# Altium schematic sheet Power.SchDoc
size A3; SheetNumber: 3; SheetTotal: 6
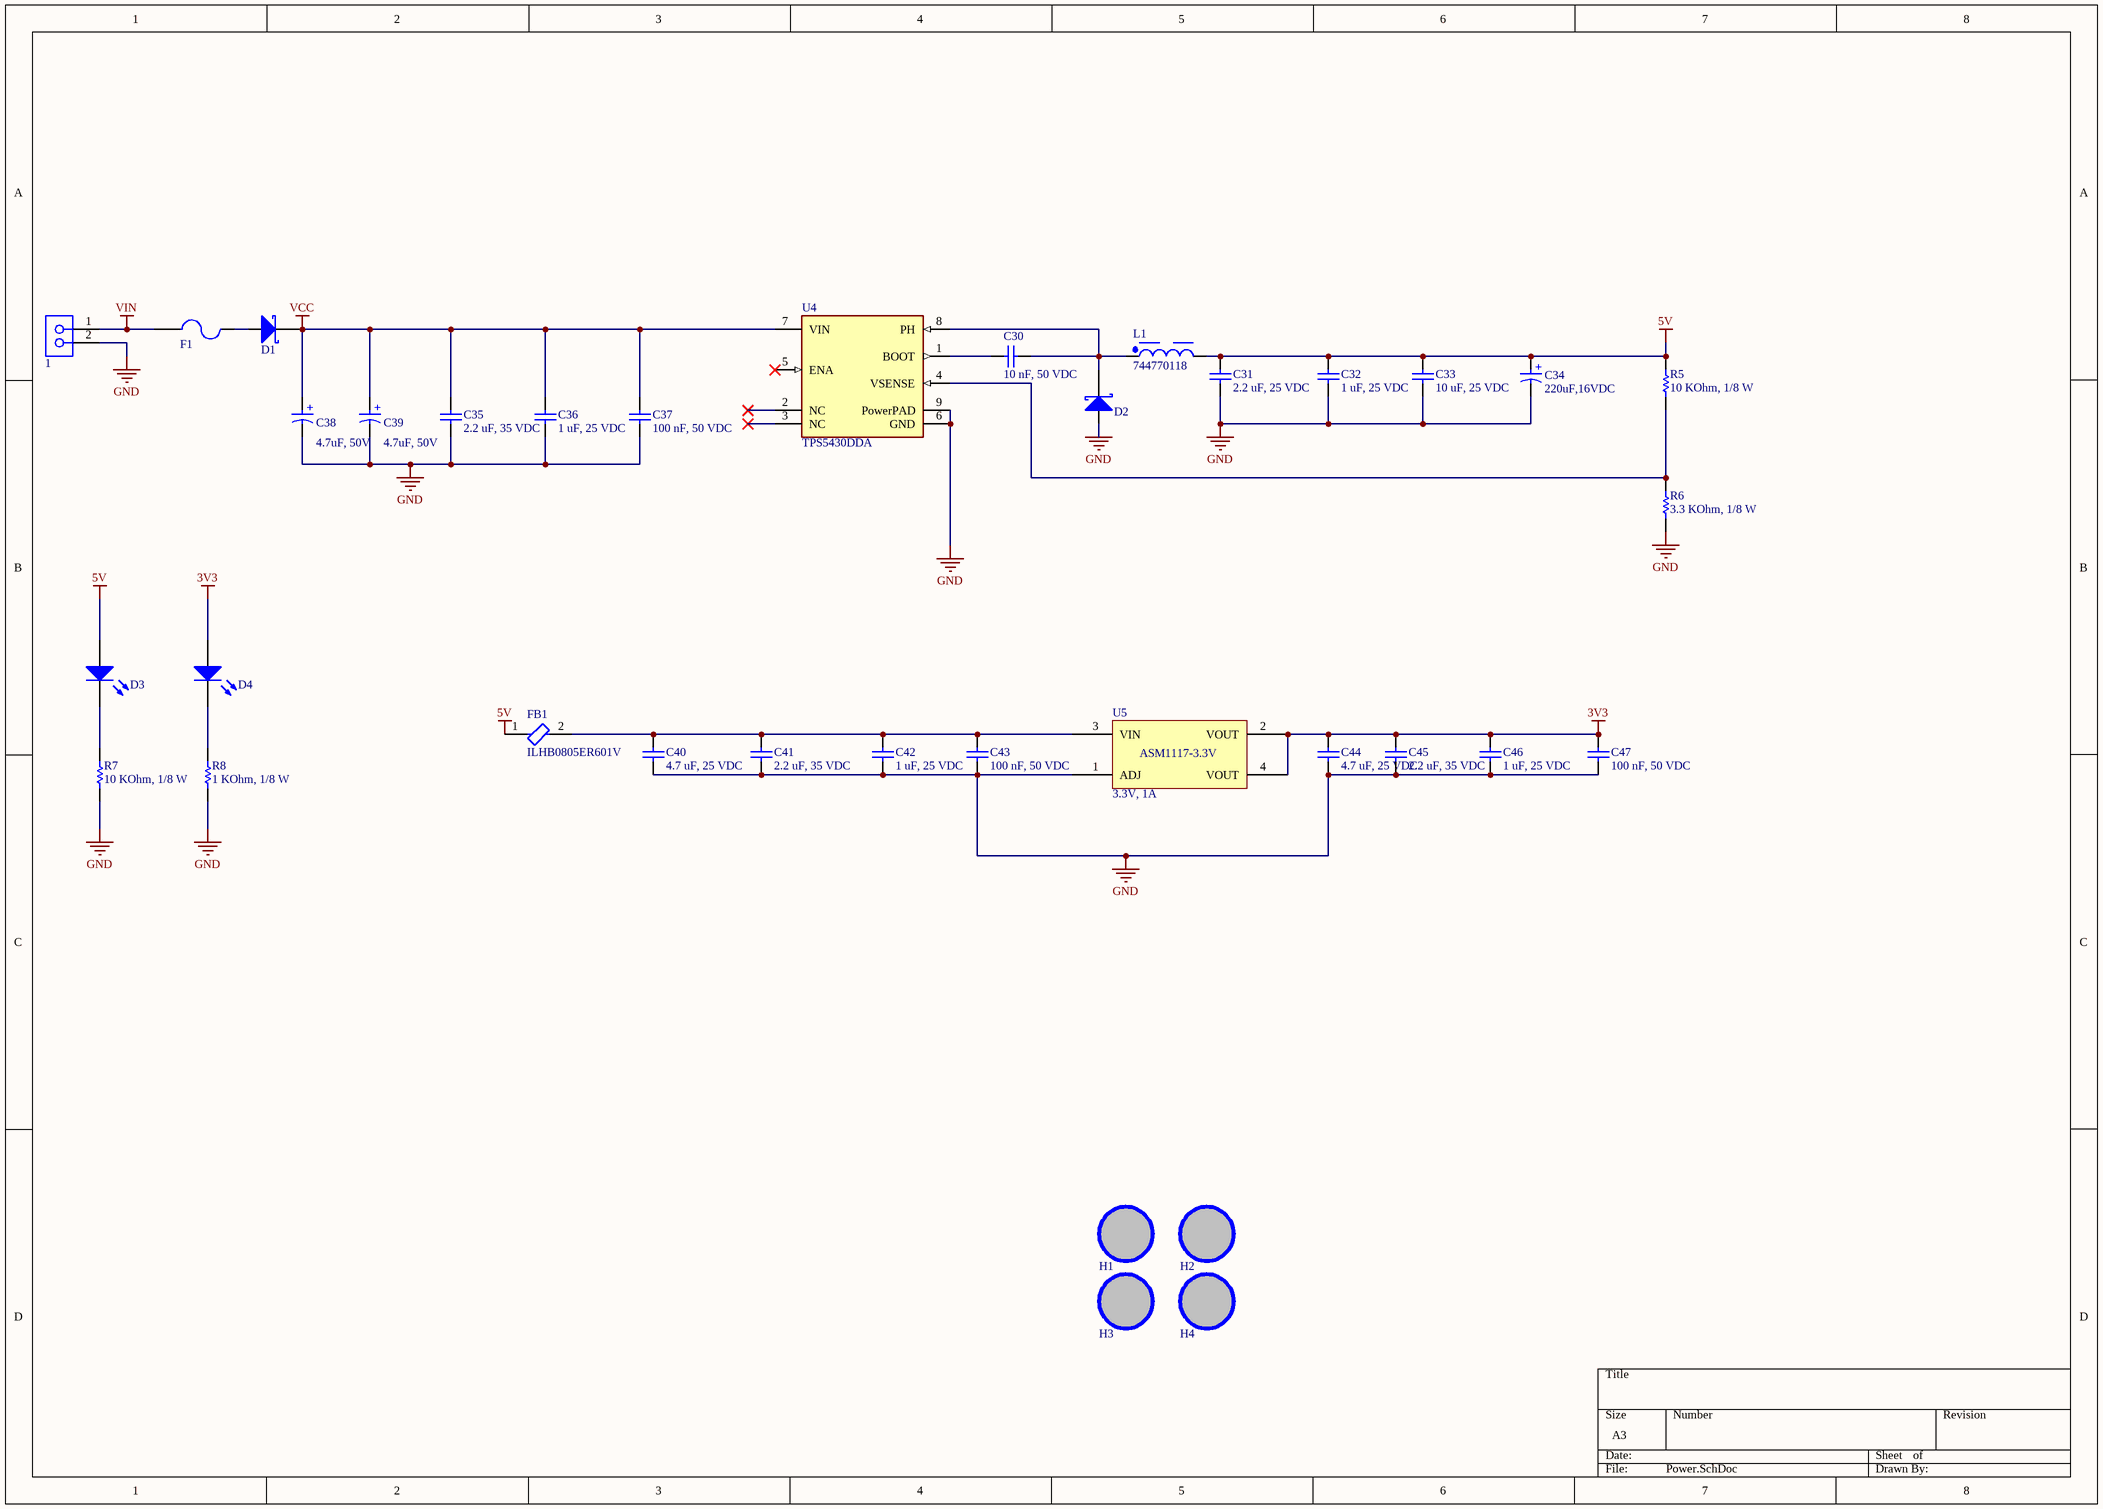
[diagram p0: Power.SchDoc]

## Parts
1  4A, 300V  [691418420002]  (value not drawn)
C30  10 nF, 50 VDC  [CAP_0805]
C31  2.2 uF, 25 VDC  [CAP_0805]
C32  1 uF, 25 VDC  [CAP_0805]
C33  10 uF, 25 VDC  [CAP_0805]
C34  220uF,16VDC  [WCAP-ASLI_D6.3H7.7]
C35  2.2 uF, 35 VDC  [CAP_0805]
C36  1 uF, 25 VDC  [CAP_0805]
C37  100 nF, 50 VDC  [CAP_0805]
C38  4.7uF, 50V  [WCAP-ASLI_D4H5.5]
C39  4.7uF, 50V  [WCAP-ASLI_D4H5.5]
C40  4.7 uF, 25 VDC  [CAP_0805]
C41  2.2 uF, 35 VDC  [CAP_0805]
C42  1 uF, 25 VDC  [CAP_0805]
C43  100 nF, 50 VDC  [CAP_0805]
C44  4.7 uF, 25 VDC  [CAP_0805]
C45  2.2 uF, 35 VDC  [CAP_0805]
C46  1 uF, 25 VDC  [CAP_0805]
C47  100 nF, 50 VDC  [CAP_0805]
D1  D Schottky  [SS34]  (value not drawn)
D2  D Schottky  [SS34]  (value not drawn)
D3  LED SMD  [LED_0805_Blue]  (value not drawn)
D4  LED SMD  [LED_0805_Blue]  (value not drawn)
F1  Fuse  [FUSE SMD]  (value not drawn)
FB1  ILHB0805ER601V  [FP-ILHB-0805-IPC_C]
H1  Hole  [LO KHOAN 3MM]  (value not drawn)
H2  Hole  [LO KHOAN 3MM]  (value not drawn)
H3  Hole  [LO KHOAN 3MM]  (value not drawn)
H4  Hole  [LO KHOAN 3MM]  (value not drawn)
L1  744770118  [WE-PD_1280]
R5  10 KOhm, 1/8 W  [RESISTOR_0805]
R6  3.3 KOhm, 1/8 W  [RESISTOR_0805]
R7  10 KOhm, 1/8 W  [RESISTOR_0805]
R8  1 KOhm, 1/8 W  [RESISTOR_0805]
U4  TPS5430DDA  [FP-DDA0008J-MFG]
U5  3.3V, 1A  [AMS1117-3.3V SOT223]

## Nets
3V3: C44.2 C45.2 C46.2 C47.2 D4.1(A) U5.2(VOUT) U5.4(VOUT)
5V: C31.2 C32.2 C33.2 C34.1(P) D3.1(A) FB1.1 L1.2 R5.2
GND: 1.2 C31.1 C32.1 C33.1 C34.2(N) C35.1 C36.1 C37.1 C38.2(N) C39.2(N) C40.1 C41.1 C42.1 C43.1 C44.1 C45.1 C46.1 C47.1 D2.1(A) R6.1 R7.1 R8.1 U4.6(GND) U4.9(PowerPAD) U5.1(ADJ)
VCC: C35.2 C36.2 C37.2 C38.1(P) C39.1(P) D1.2(K) U4.7(VIN)
VIN: 1.1 F1.1
NetC30_1: C30.1 D2.2(K) L1.1 U4.8(PH)
NetC30_2: C30.2 U4.1(BOOT)
NetC40_2: C40.2 C41.2 C42.2 C43.2 FB1.2 U5.3(VIN)
NetD1_1: D1.1(A) F1.2
NetD3_2: D3.2(K) R7.2
NetD4_2: D4.2(K) R8.2
NetR5_1: R5.1 R6.2 U4.4(VSENSE)

Not connected (* = marked no-connect by the designer): H1 1; H2 1; H3 1; H4 1; U4 2(NC)* 3(NC)* 5(ENA)*

## Notes on the sheet
- (in symbol 865080345012) +
- (in symbol 865080640004) +
- (in symbol AMS1117-3.3V) ASM1117-3.3V

## Library data of the parts
1 = 691418420002: WR-TBL Series 4184 45° Entry, THT, pitch 7.62mm, 2p; Manufacturer: Wurth Elektronik; Modularity: No; ComponentLink1Description: Datasheet Link; ComponentLink1URL: https://www.we-online.com/redexpert/spec/691418420002?ad; ComponentLink2Description: Supplier 1 URL; ComponentLink2URL: N/A; Manufacturer Part Number: 691418420002; Category: Terminal Blocks; Match Code: WR-TBL; Mount: Through Hole; Operating Temperature Max: 120°C; Operating Temperature Min: -30°C; Packaging: Box; Application: Screwless; Number of Pins: 2; Number of Rows: 1; Orientation: 45°; Pitch: 7.62mm; Rated Current: 4A; Working Voltage: 300V; ComponentLink3Description: Supplier 2 URL; ComponentLink3URL: N/A; ComponentLink4Description: Supplier 3 URL; ComponentLink4URL: https://www.thegioiic.com/hb762-2-terminal-khoi-han-pcb-2-cuc-24a-450v-7-62mm; Supplier 1 Name: Mouser; Supplier 1 SN: N/A; Supplier 1 URL: N/A; Supplier 2 Name: Digi-Key; Supplier 2 SN: N/A; Supplier 2 URL: N/A; Supplier 3 Name: thegioiic; Supplier 3 SN: N/A; Supplier 3 URL: https://www.thegioiic.com/hb762-2-terminal-khoi-han-pcb-2-cuc-24a-450v-7-62mm; Value: 4A, 300V
C30 = 0108051031050: CAP, size 0805, 10 nF, 50 VDC; Manufacture Name: TDK; Manufacture SN: CGA4C2C0G1H103J060AA; Capacitance: 10 nF; Tolerance: +/-5%; Voltage Rating DC: 50 VDC; ComponentLink2Description: Datasheet; ComponentLink2URL: https://product.tdk.com/system/files/dam/doc/product/capacitor/ceramic/mlcc/catalog/mlcc_automotive_general_en.pdf?ref_disty=mouser; Operating Temperature: -55 to +125degC; Packaging: Tape and Reel; Mounting Technology: SMT; Size: 0805; Supplier 1 Name: Mouser; Supplier 1 SN: 810-CGA4C2C0G1H103J; Supplier 1 URL: https://www.mouser.vn/ProductDetail/TDK/CGA4C2C0G1H103J060AA?qs=FxQuwy19cyC9M6v0nMqjhA%3D%3D&utm_source=mouser-refine-download&utm_medium=file&utm_campaign=CGA4C2C0G1H103J060AA&utm_content=TDK; Supplier 2 Name: Digi-Key; Supplier 2 SN: 445-6947-2-ND; Supplier 2 URL: https://www.digikey.com/en/products/detail/tdk-corporation/cga4c2c0g1h103j060aa/2672840; Supplier 3 Name: thegioiic; Supplier 3 SN: OEM; Supplier 3 URL: N/A; Value: 10 nF, 50 VDC
C31 = 0108052251025: CAP, size 0805, 2.2 uF, 25 VDC; Manufacture Name: TDK; Manufacture SN: CGA4J3X7R1E225K125AD; Capacitance: 2.2 uF; Tolerance: +/-10%; Voltage Rating DC: 25 VDC; ComponentLink2Description: Datasheet; ComponentLink2URL: https://product.tdk.com/system/files/dam/doc/product/capacitor/ceramic/mlcc/catalog/mlcc_automotive_epoxy_en.pdf?ref_disty=mouser; Operating Temperature: -55 to +125degC; Packaging: Tape and Reel; Mounting Technology: SMT; Size: 0805; Supplier 1 Name: Mouser; Supplier 1 SN: 810-CGA4J3X7R1E225KD; Supplier 1 URL: https://www.mouser.vn/ProductDetail/TDK/CGA4J3X7R1E225K125AD?qs=xLDY6iXSiQZ6drRfaPQTzQ%3D%3D&utm_source=mouser-refine-download&utm_medium=file&utm_campaign=CGA4J3X7R1E225K125AD&utm_content=TDK; Supplier 2 Name: Digi-Key; Supplier 2 SN: 445-9923-2-ND; Supplier 2 URL: https://www.digikey.com/en/products/detail/tdk-corporation/cga4j3x7r1e225k125ad/3933656; Supplier 3 Name: thegioiic; Supplier 3 SN: OEM; Supplier 3 URL: N/A; Value: 2.2 uF, 25 VDC
C32 C36 C42 C46 = 0108051051025: CAP, size 0805, 1 uF, 25 VDC; Manufacture Name: TDK; Manufacture SN: CGA4J1X8R1E105K125AE; Capacitance: 1 uF; Tolerance: +/-10%; Voltage Rating DC: 25 VDC; ComponentLink2Description: Datasheet; ComponentLink2URL: https://product.tdk.com/system/files/dam/doc/product/capacitor/ceramic/mlcc/catalog/mlcc_automotive_soft_en.pdf?ref_disty=mouser; Operating Temperature: -55 to +125degC; Packaging: Tape and Reel; Mounting Technology: SMT; Size: 0805; Supplier 1 Name: Mouser; Supplier 1 SN: 810-A4J1X815K125AE; Supplier 1 URL: https://www.mouser.vn/ProductDetail/TDK/CGA4J1X8R1E105K125AE?qs=Ii670aiJhr6VRhkBsruYJg%3D%3D&utm_source=mouser-refine-download&utm_medium=file&utm_campaign=CGA4J1X8R1E105K125AE&utm_content=TDK; Supplier 2 Name: Digi-Key; Supplier 2 SN: 445-174807-2-ND; Supplier 2 URL: https://www.digikey.com/en/products/detail/tdk-corporation/cga4j1x8r1e105k125ae/6556490; Supplier 3 Name: thegioiic; Supplier 3 SN: OEM; Supplier 3 URL: N/A; Value: 1 uF, 25 VDC
C33 = 0108051061025: CAP, size 0805, 10 uF, 25 VDC; Manufacture Name: TDK; Manufacture SN: CGA4J1X7S1E106K125AE; Capacitance: 10 uF; Tolerance: +/-10%; Voltage Rating DC: 25 VDC; ComponentLink2Description: Datasheet; ComponentLink2URL: https://product.tdk.com/system/files/dam/doc/product/capacitor/ceramic/mlcc/catalog/mlcc_automotive_soft_en.pdf?ref_disty=mouser; Operating Temperature: -55 to +125degC; Packaging: Tape and Reel; Mounting Technology: SMT; Size: 0805; Supplier 1 Name: Mouser; Supplier 1 SN: 810-CGA4J1X7S1E106K2; Supplier 1 URL: https://www.mouser.vn/ProductDetail/TDK/CGA4J1X7S1E106K125AE?qs=PqoDHHvF64%252BJvhmUzM2odA%3D%3D&utm_source=mouser-refine-download&utm_medium=file&utm_campaign=CGA4J1X7S1E106K125AE&utm_content=TDK; Supplier 2 Name: Digi-Key; Supplier 2 SN: 445-181411-2-ND; Supplier 2 URL: https://www.digikey.com/en/products/detail/tdk-corporation/cga4j1x7s1e106k125ae/9744777; Supplier 3 Name: thegioiic; Supplier 3 SN: OEM; Supplier 3 URL: N/A; Value: 10 uF, 25 VDC
C34 = 865080345012: V-Chip, D6.3 x H7.7mm, 220uF, 16V; Manufacturer: Wurth Elektronik; Capacitance Tolerance: +/-20%; Dissipation Factor: 16%; Endurance: 2000h; Leakage Current: 35.2uA; Ripple Current: 275mA; Category: Aluminum Electrolytic Capacitors; ComponentLink2Description: Datasheet Link; ComponentLink2URL: https://www.we-online.com/redexpert/spec/865080345012?ad; Mount: Surface Mount; Operating Temperature Max: 105°C; Operating Temperature Min: -55°C; Packaging: Tape and Reel; Height: 7.7mm; Diameter: 6.3mm; Capacitance: 220uF; Rated Voltage (DC): 16V; Supplier 1 Name: Mouser; Supplier 1 SN: 710-865080345012; Supplier 1 URL: https://www.mouser.com/ProductDetail/Wurth-Elektronik/865080345012?qs=0KOYDY2FL28fdpLe2qFZOQ%3D%3D; Supplier 3 Name: thegioiic; Supplier 3 URL: https://www.thegioiic.com/tu-nhom-smd-220uf-16v-6-3x7-7mm; Manufacturer Part Number: N/A; Supplier 2 Name: Digi-Key; Supplier 2 SN: N/A; Supplier 2 URL: N/A; Supplier 3 SN: N/A; Value: 220uF, 16V
C35 C41 C45 = 0108052251035: CAP, size 0805, 2.2 uF, 35 VDC; Manufacture Name: TDK; Manufacture SN: CGA4J1X7R1V225K125AC; Capacitance: 2.2 uF; Tolerance: +/-10%; Voltage Rating DC: 35 VDC; ComponentLink2Description: Datasheet; ComponentLink2URL: https://product.tdk.com/system/files/dam/doc/product/capacitor/ceramic/mlcc/catalog/mlcc_automotive_general_en.pdf?ref_disty=mouser; Operating Temperature: -55 to +125degC; Packaging: Tape and Reel; Mounting Technology: SMT; Size: 0805; Supplier 1 Name: Mouser; Supplier 1 SN: 810-CGA4J1X7R1V225K; Supplier 1 URL: https://www.mouser.vn/ProductDetail/TDK/CGA4J1X7R1V225K125AC?qs=NRhsANhppD%2FTd0jz18r29g%3D%3D&utm_source=mouser-refine-download&utm_medium=file&utm_campaign=CGA4J1X7R1V225K125AC&utm_content=TDK; Supplier 2 Name: Digi-Key; Supplier 2 SN: 445-6963-2-ND; Supplier 2 URL: https://www.digikey.com/en/products/detail/tdk-corporation/cga4j1x7r1v225k125ac/2672856; Supplier 3 Name: thegioiic; Supplier 3 SN: OEM; Supplier 3 URL: N/A; Value: 2.2 uF, 35 VDC
C37 C43 C47 = 0108051041050: CAP, size 0805, 100 nF, 50 VDC; Manufacture Name: TDK; Manufacture SN: CGA4J2X8R1H104K125AD; Capacitance: 0.1 nF; Tolerance: +/-10%; Voltage Rating DC: 50 VDC; Value: 0.1 nF, 50 VDC; ComponentLink2Description: Datasheet; ComponentLink2URL: https://product.tdk.com/system/files/dam/doc/product/capacitor/ceramic/mlcc/catalog/mlcc_automotive_epoxy_en.pdf?ref_disty=mouser; Operating Temperature: -55 to +125degC; Packaging: Tape and Reel; Mounting Technology: SMT; Size: 0805; Supplier 1 Name: Mouser; Supplier 1 SN: 810-C2012X8R1H104KEP; Supplier 1 URL: https://www.mouser.vn/ProductDetail/TDK/CGA4J2X8R1H104K125AD?qs=LcTL%2F5vFEzExqZqv3rh1qQ%3D%3D&utm_source=mouser-refine-download&utm_medium=file&utm_campaign=CGA4J2X8R1H104K125AD&utm_content=TDK; Supplier 2 Name: Digi-Key; Supplier 2 SN: 445-8810-2-ND; Supplier 2 URL: https://www.digikey.com/en/products/detail/tdk-corporation/cga4j2x8r1h104k125ad/3248169; Supplier 3 Name: thegioiic; Supplier 3 SN: OEM; Supplier 3 URL: N/A
C38 C39 = 865080640004: V-Chip, D4 x H5.5mm, 4.7uF, 50V; Manufacturer: Wurth Elektronik; Capacitance Tolerance: +/-20%; Dissipation Factor: 12%; Endurance: 2000h; Leakage Current: 3uA; Ripple Current: 55mA; Category: Aluminum Electrolytic Capacitors; ComponentLink2Description: Datasheet Link; ComponentLink2URL: https://www.we-online.com/redexpert/spec/865080640004?ad; Mount: Surface Mount; Operating Temperature Max: 105°C; Operating Temperature Min: -55°C; Packaging: Tape and Reel; Height: 5.5mm; Diameter: 4mm; Capacitance: 4.7uF; Rated Voltage (DC): 50V; Supplier 1 Name: Mouser; Supplier 1 SN: 710-865080640004; Supplier 1 URL: https://www.mouser.vn/ProductDetail/Wurth-Elektronik/865080640004?qs=0KOYDY2FL2%2FjY4kqBxIvAg%3D%3D; Supplier 3 Name: thegioiic; Supplier 3 URL: https://www.thegioiic.com/product/tu-hoa-nhom?prid=6714,5972; Manufacturer Part Number: N/A; Supplier 2 Name: Digi-Key; Supplier 2 SN: N/A; Supplier 2 URL: N/A; Supplier 3 SN: N/A; Value: 4.7uF, 50V
C40 C44 = 0108054751025: CAP, size 0805, 4.7 uF, 25 VDC; Manufacture Name: TDK; Manufacture SN: CGA4J1X8L1E475K125AC; Capacitance: 4.7 uF; Tolerance: +/-10%; Voltage Rating DC: 25 VDC; ComponentLink2Description: Datasheet; ComponentLink2URL: https://product.tdk.com/system/files/dam/doc/product/capacitor/ceramic/mlcc/catalog/mlcc_automotive_hightemp_en.pdf?ref_disty=mouser; Operating Temperature: -55 to +125degC; Packaging: Tape and Reel; Mounting Technology: SMT; Size: 0805; Supplier 1 Name: Mouser; Supplier 1 SN: 810-CGA4J1X8L1E125AC; Supplier 1 URL: https://www.mouser.vn/ProductDetail/TDK/CGA4J1X8L1E475K125AC?qs=gZXFycFWdANxpKJOMQuJTA%3D%3D&utm_source=mouser-refine-download&utm_medium=file&utm_campaign=CGA4J1X8L1E475K125AC&utm_content=TDK; Supplier 2 Name: Digi-Key; Supplier 2 SN: 445-181605-2-ND; Supplier 2 URL: https://www.digikey.com/en/products/detail/tdk-corporation/cga4j1x8l1e475k125ac/9991390; Supplier 3 Name: thegioiic; Supplier 3 SN: OEM; Supplier 3 URL: N/A; Value: 4.7 uF, 25 VDC
D1 D2 = D Schottky: Schottky Diode; Published: 8-Jun-2000; LatestRevisionDate: 17-Jul-2002; LatestRevisionNote: Re-released for DXP Platform.; PackageReference: SMB; Publisher: Altium Limited; PackageDescription: DO-214-AA/SMB; 2 C-Bend Leads; Body 5.3 x 3.6 mm, inc. leads (LxW); Code_JEDEC: DO-214-AA
D3 D4 = LED SMD: LED
FB1 = CMP-02428-000001-1: FERRITE BEAD 600 OHM 0805 1LN; Manufacturer: Vishay; Tolerance: 25%; Shielding: true; Test Frequency: 100MHz; Impedance At Frequency: 600Ω @ 100MHz; Series Resistance: 0.1Ω; Rms Current: 2000mA; ComponentLink2URL: http://www.vishay.com/docs/34102/ilhb.pdf; Octopart: https://octopart.com/ilhb0805er601v-vishay-39650184; Automotive: No; Height: 1.1mm; Mouser Description: Ferrite Beads Multi-Layer High Current 600Ohm 25% 100MHz 2A 100mOhm DCR 0805 T/R; ComponentLink2Description: Datasheet; Device Class L2: EMI / RFI Components; Lead Free: Yes; Ipc Land Pattern Name: CAPC200125X90; Package: ILHB-0805; Manufacturer Part Number: ILHB0805ER601V; Device Class L1: Passive Components; Digikey Description: FERRITE BEAD 600 OHM 0805 1LN; Category: FBead; Temperature Range High: +125°C; Temperature: -55°C to +125°C; RoHS: TRUE; Temperature Range Low: -55°C; Device Class L3: Ferrite Beads and Chips
H1-H4 = Hole: Hole 3mm
L1 = CMP-0227-00203-2: NexarPartId: 22866872; Inductance Tolerance: 20%; Inductance: 18µH; DC Resistance (DCR): 25mΩ; Current Rating: 5A; Self Resonant Frequency: 13.2MHz; Resistance: 32mΩ; Ambient Temperature Range Low: -40°C; Min Operating Temperature: -40°C; Ambient Temperature Range High: 85°C; Max Operating Temperature: 125°C; Height: 8mm; Packaging: Cut Tape (CT); Number of Pins: 2; Width: 12mm; Length: 12mm; RoHS: Compliant
R5 = 0008051035: RES, size 0805, 10 KOhm, 1/8 W; Manufacture  Name: Vishay Dale; Manufacture  SN: CRCW080510K0JNEAC; Resistance tolerance: +/-5%; Rated Power: 1/8 W; Resistance: 10 KOhm; Size: 0805; Mounting Technology: SMT; Supplier 1 Name: Mouser; Supplier 1 SN: 71-CRCW080510K0JNEB; Supplier 1 URL: https://www.mouser.vn/ProductDetail/Vishay-Dale/CRCW080510K0JNEB?qs=LOX6nxTstiZ5fn9YUdHx5A%3D%3D; Supplier 2 Name: Digi-Key; Supplier 2 SN: 541-4163-2-ND; Supplier 2 URL: https://www.digikey.com/en/products/detail/vishay-dale/CRCW080510K0JNEAC/7928585; Supplier 3 Name: Thegioiic; Supplier 3 SN: N/A; Supplier 3 URL: N/A; Value: 10 KOhm, 1/8 W; ComponentLink1Description: Datasheet link; ComponentLink1URL: https://www.vishay.com/docs/28773/crcwce3.pdf; ComponentLink2Description: Supplier 1 URL; ComponentLink2URL: https://www.mouser.vn/ProductDetail/Vishay-Dale/CRCW080510K0JNEB?qs=LOX6nxTstiZ5fn9YUdHx5A%3D%3D; ComponentLink3Description: Supplier 2 URL; ComponentLink3URL: https://www.digikey.com/en/products/detail/vishay-dale/CRCW080510K0JNEAC/7928585; ComponentLink4Description: Supplier 3 URL; ComponentLink4URL: N/A
R6 = 0008053325: RES, size 0805, 3.3 KOhm, 1/8 W; Manufacture  Name: Panasonic; Manufacture  SN: ERJ-S06J332V; Resistance tolerance: +/-5%; Rated Power: 1/8 W; Size: 0805; Mounting Technology: SMT; Resistance: 3.3 KOhm; Supplier 1 Name: Mouser; Supplier 1 SN: 667-ERJ-S06J332V; Supplier 1 URL: https://www.mouser.vn/ProductDetail/Panasonic/ERJ-S06J332V?qs=Lnc17S3XxqC89pwdWk%2FMHQ%3D%3D; Supplier 2 Name: Digi-Key; Supplier 2 SN: P3.3KATR-ND - Tape & Reel (TR); Supplier 2 URL: https://www.digikey.com/en/products/detail/panasonic-electronic-components/ERJ-6GEYJ332V/83038; Supplier 3 Name: Thegioiic; Supplier 3 SN: N/A; Supplier 3 URL: https://www.thegioiic.com/dien-tro-3-3-kohm-0805-5; Value: 3.3 KOhm, 1/8 W; ComponentLink1Description: Datasheet link; ComponentLink1URL: https://www.mouser.vn/datasheet/2/315/AOA0000C334-1314047.pdf; ComponentLink2Description: Supplier 1 URL; ComponentLink2URL: https://www.mouser.vn/ProductDetail/Panasonic/ERJ-S06J332V?qs=Lnc17S3XxqC89pwdWk%2FMHQ%3D%3D; ComponentLink3Description: Supplier 2 URL; ComponentLink3URL: https://www.digikey.com/en/products/detail/panasonic-electronic-components/ERJ-6GEYJ332V/83038; ComponentLink4Description: Supplier 3 URL; ComponentLink4URL: https://www.thegioiic.com/dien-tro-3-3-kohm-0805-5
R7 = 0008051031: RES, size 0805, 10 KOhm, 1/8 W; Resistance tolerance: +/-1%; Rated Power: 1/8 W; Resistance: 10 KOhm; Size: 0805; Mounting Technology: SMT; Supplier 1 Name: Mouser; Supplier 1 SN: N/A; Supplier 1 URL: N/A; Supplier 2 Name: Digi-Key; Supplier 2 SN: N/A; Supplier 2 URL: N/A; Supplier 3 Name: Thegioiic; Supplier 3 SN: N/A; Supplier 3 URL: https://www.thegioiic.com/dien-tro-1-kohm-0805-1; Manufacture  Name: N/A; Manufacture  SN: N/A; Value: 10 KOhm, 1/8 W; ComponentLink1Description: Datasheet link; ComponentLink1URL: N/A; ComponentLink2Description: Supplier 1 URL; ComponentLink2URL: N/A; ComponentLink3Description: Supplier 2 URL; ComponentLink3URL: N/A; ComponentLink4Description: Supplier 3 URL; ComponentLink4URL: https://www.thegioiic.com/dien-tro-1-kohm-0805-1
R8 = 0008051025: RES, size 0805, 1 KOhm, 1/8 W; Manufacture  Name: Vishay Dale; Manufacture  SN: CRCW08051K00JNEAC; Resistance tolerance: +/-5%; Rated Power: 1/8 W; Resistance: 1 KOhm; Size: 0805; Mounting Technology: SMT; Supplier 1 Name: Mouser; Supplier 1 SN: 71-CRCW08051K00JNEC; Supplier 1 URL: https://www.mouser.vn/ProductDetail/Vishay-Dale/CRCW08051K00JNEC?qs=OW6ROCK%252BaiZqKFsNe9zjFw%3D%3D; Supplier 2 Name: Digi-Key; Supplier 2 SN: 541-4162-2-ND; Supplier 2 URL: https://www.digikey.com/en/products/detail/vishay-dale/CRCW08051K00JNEAC/7928584; Supplier 3 Name: Thegioiic; Supplier 3 SN: N/A; Supplier 3 URL: https://www.thegioiic.com/dien-tro-1-kohm-0805-5-; Value: 1 KOhm, 1/8 W; ComponentLink1Description: Datasheet link; ComponentLink1URL: https://www.vishay.com/docs/28773/crcwce3.pdf; ComponentLink2Description: Supplier 1 URL; ComponentLink2URL: https://www.mouser.vn/ProductDetail/Vishay-Dale/CRCW08051K00JNEC?qs=OW6ROCK%252BaiZqKFsNe9zjFw%3D%3D; ComponentLink3Description: Supplier 2 URL; ComponentLink3URL: https://www.digikey.com/en/products/detail/vishay-dale/CRCW08051K00JNEAC/7928584; ComponentLink4Description: Supplier 3 URL; ComponentLink4URL: https://www.thegioiic.com/dien-tro-1-kohm-0805-5-
U4 = CMP-2000-04960-2: IC REG BUCK ADJUSTABLE 3A 8SOPWR; Manufacturer: Texas Instruments; Max Junction Temp: +125°C; Max Supply Voltage: 36V; Switching Frequency: 500kHz; Output Type: AdjustableProgrammable; Standoff Height: 0mm; Output Voltage: 1.23-31V; Max Duty Cycle: 89%; Nominal Supply Current: 3mA; Min Supply Voltage: 5.5V; Number Of Outputs: 1; Temperature: -40°C to +125°C; Temperature Range High: +125°C; Manufacturer Part Number: TPS5430DDA; Device Class L3: Voltage Regulators - Switching; Mouser Description: Voltage Regulators - Switching Regulators 5.5 to 36V Input 3A Step Dwn Converter; Switching Topology: Buck; ComponentLink2URL: http://www.ti.com/lit/ds/symlink/tps5431.pdf; ComponentLink2Description: Datasheet; Device Class L2: Power Management ICs; Device Class L1: Integrated Circuits (ICs); Digikey Description: IC REG BUCK ADJUSTABLE 3A 8SOPWR; RoHS: TRUE; Octopart: https://octopart.com/tps5430dda-texas+instruments-589977; Output Current: 3A; Automotive: No; Lead Free: Yes; Category: IC; Package: DDA0008J; Temperature Range Low: -40°C; Height: 1.7mm
U5 = AMS1117-3.3V: AMS1117-3.3V, OUT 3.3V 1A.; Manufacturer: AMS; Pad Count: 4; Voltage Input Maximum: 15V; Manufacturer Part Number: N/A; Current Input Maximum: N/A; Current Output Maximum: 1A; Supplier 1 Name: Mouser; Supplier 2 Name: Digi-Key; Supplier 3 Name: thegioiic; Voltage Output: 3.3V; Mounting Technology: SMD; ComponentLink1Description: Datasheet link; ComponentLink1URL: http://www.advanced-monolithic.com/pdf/ds1117.pdf; ComponentLink2Description: Supplier 1 URL; ComponentLink2URL: N/A; ComponentLink3Description: Supplier 2 URL; ComponentLink3URL: N/A; ComponentLink4Description: Supplier 3 URL; ComponentLink4URL: N/A; Supplier 1 SN: N/A; Supplier 1 URL: N/A; Supplier 2 SN: N/A; Supplier 2 URL: N/A; Supplier 3 SN: N/A; Supplier 3 URL: https://www.thegioiic.com/ams1117-3-3v-ic-on-ap-3-3v-1a-sot-223; Value: 3.3V, 1A